# EAGLE schematic MARI_SCH (EAGLE 9.7.0)
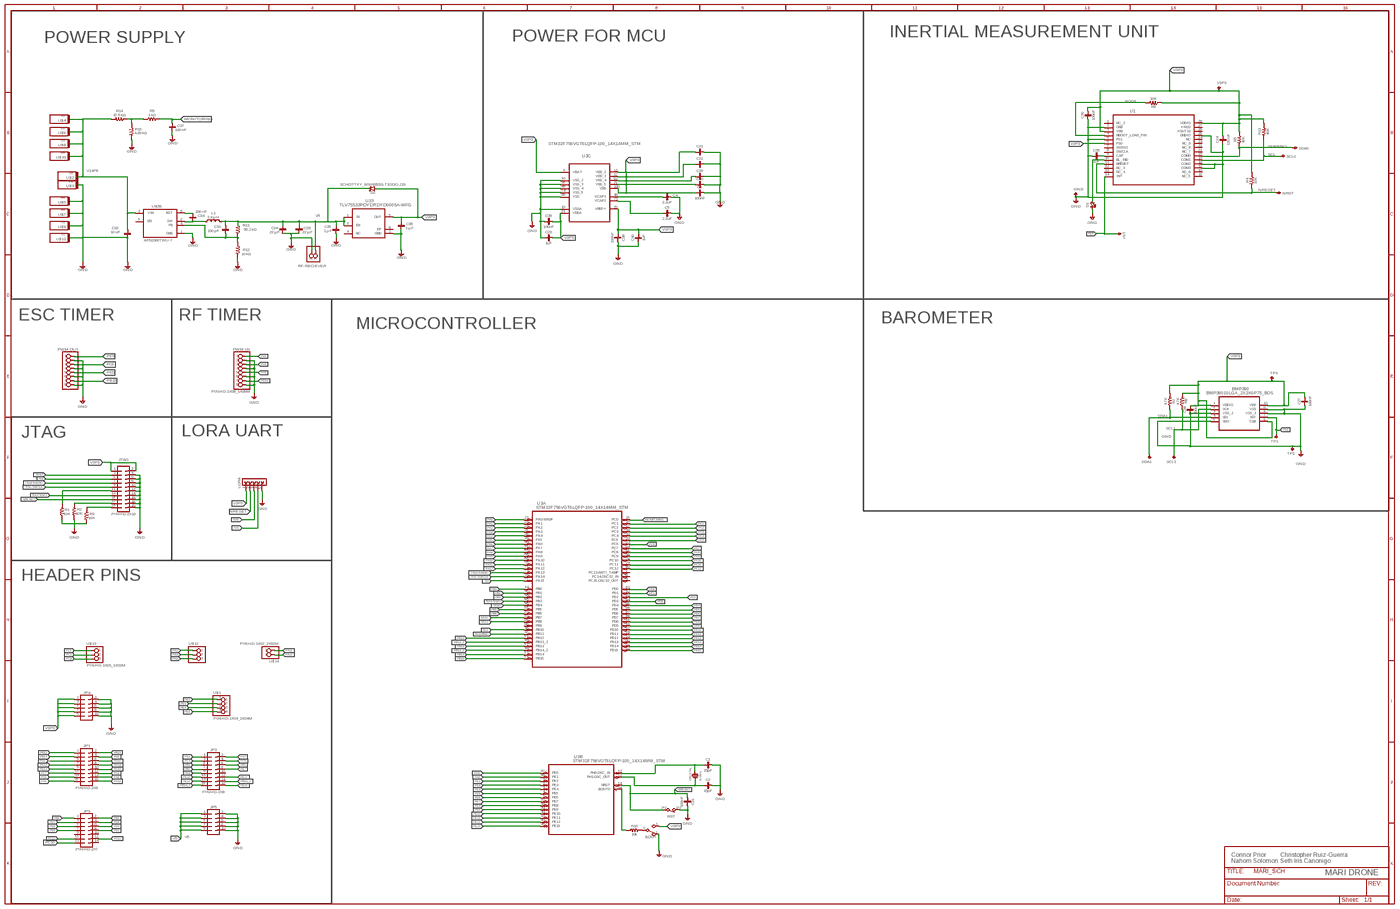
[diagram p0: schematic, sheet 1, overview]
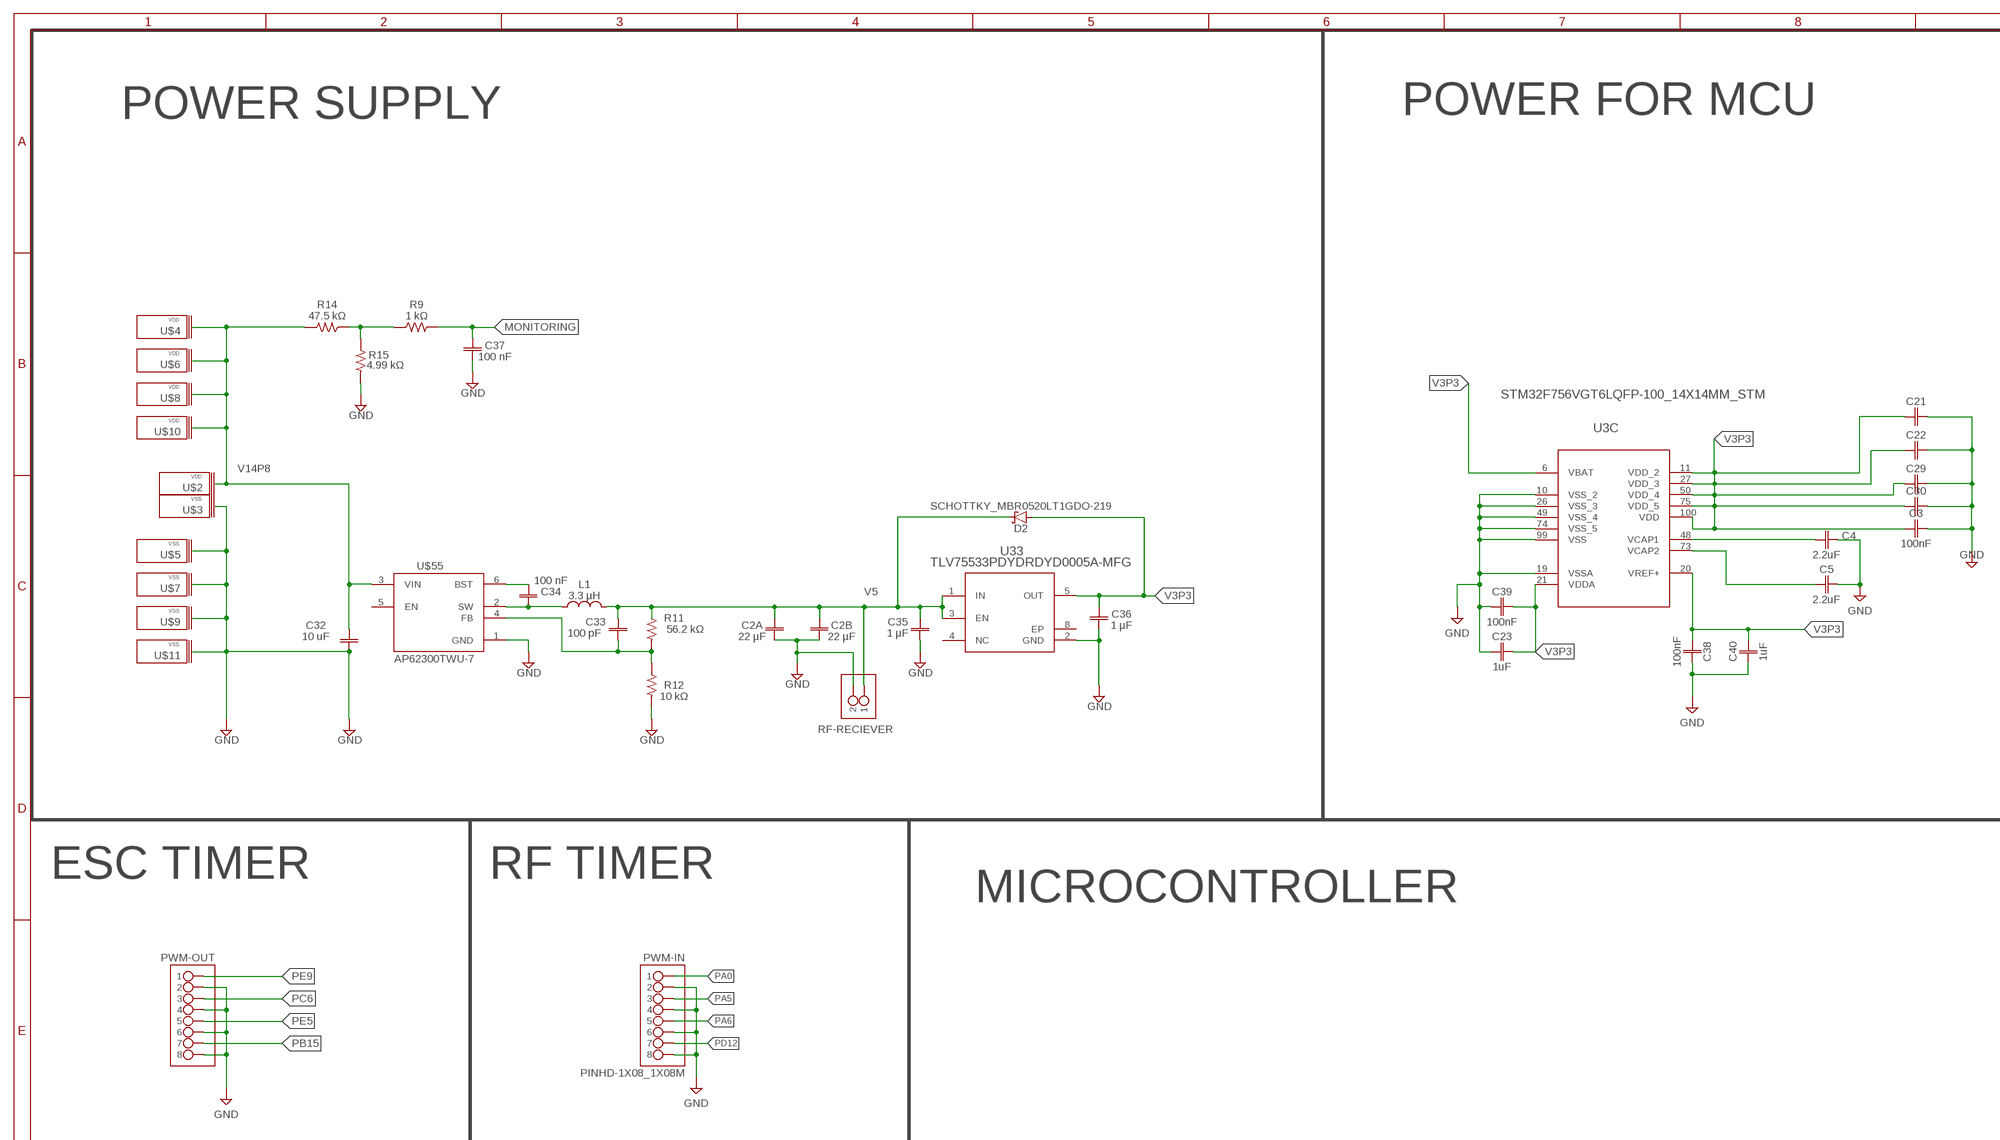
[diagram p1: schematic, sheet 1, part 1 of 4]
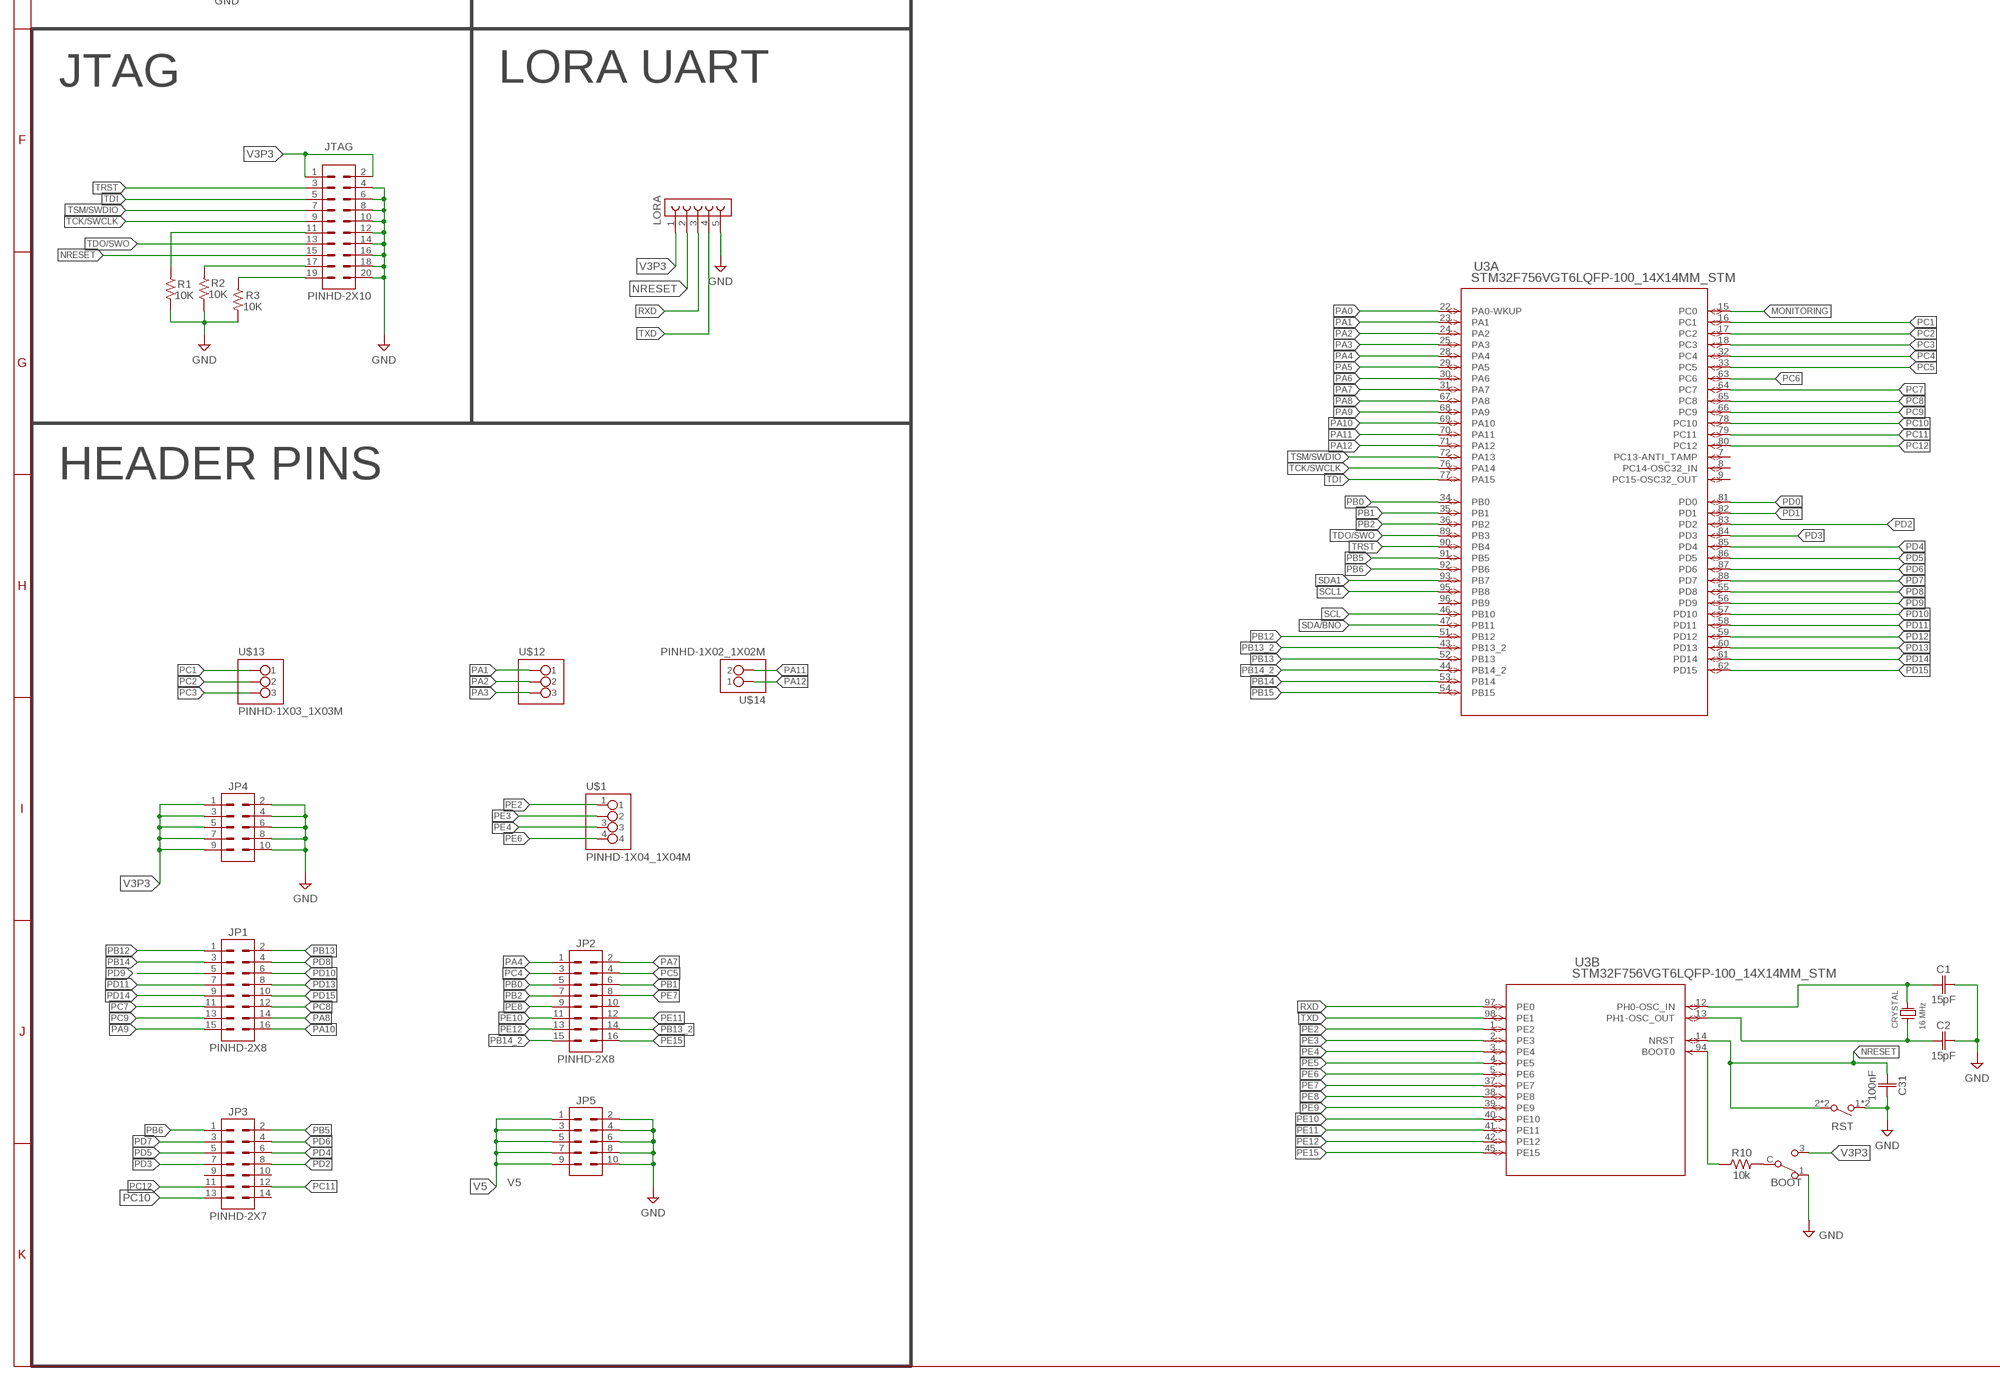
[diagram p2: schematic, sheet 1, part 2 of 4]
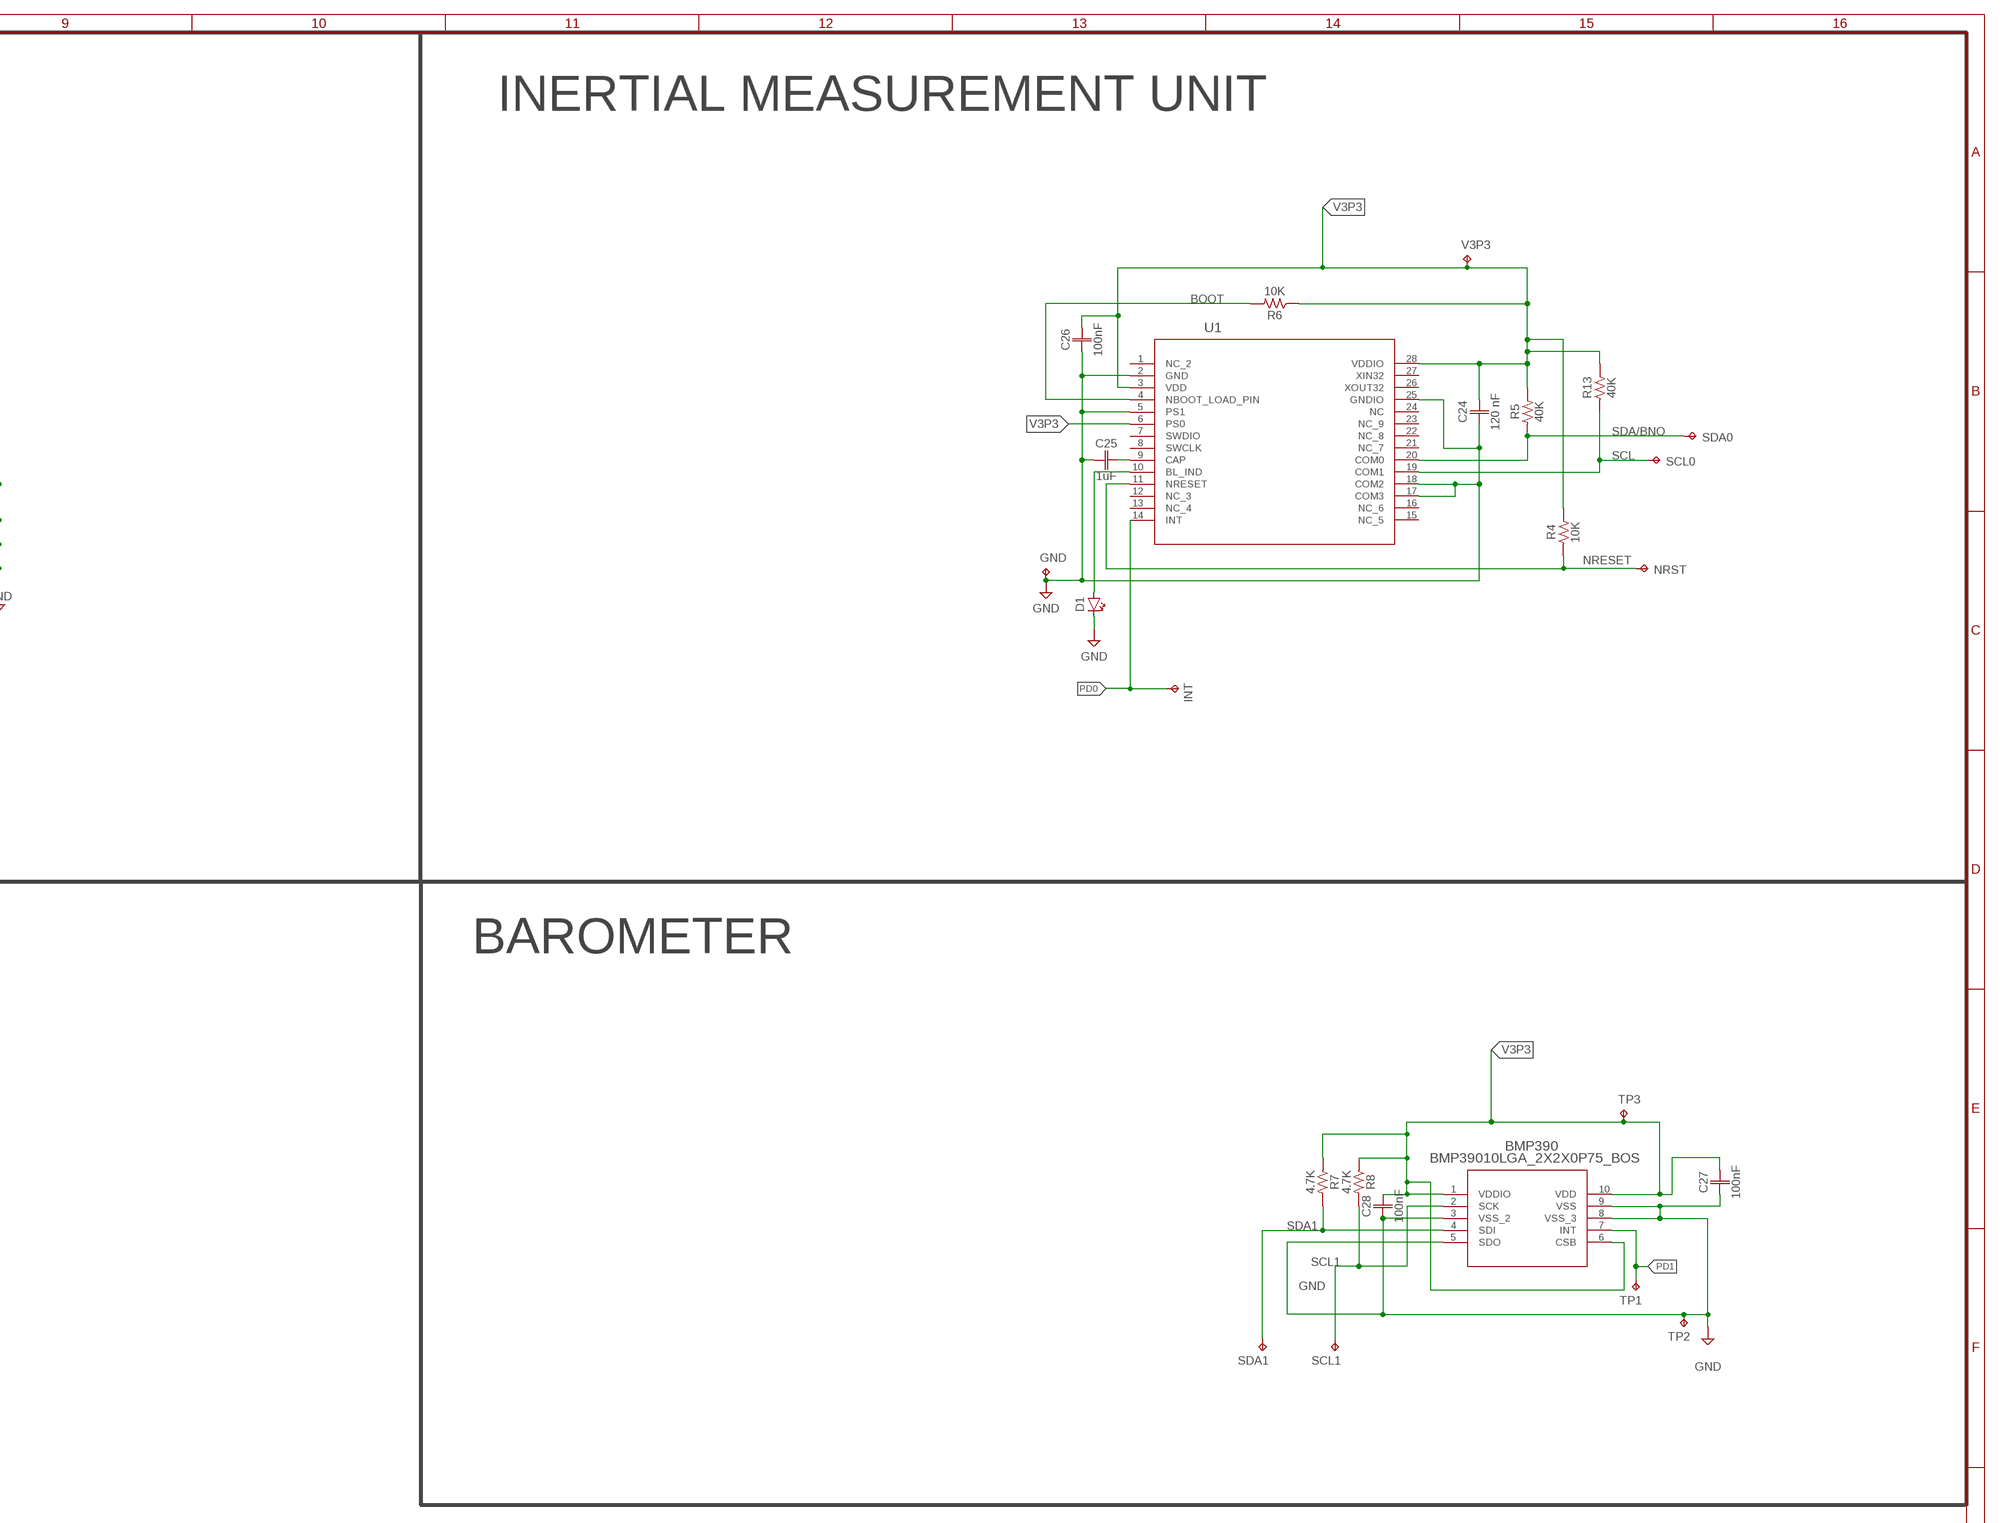
[diagram p3: schematic, sheet 1, part 3 of 4]
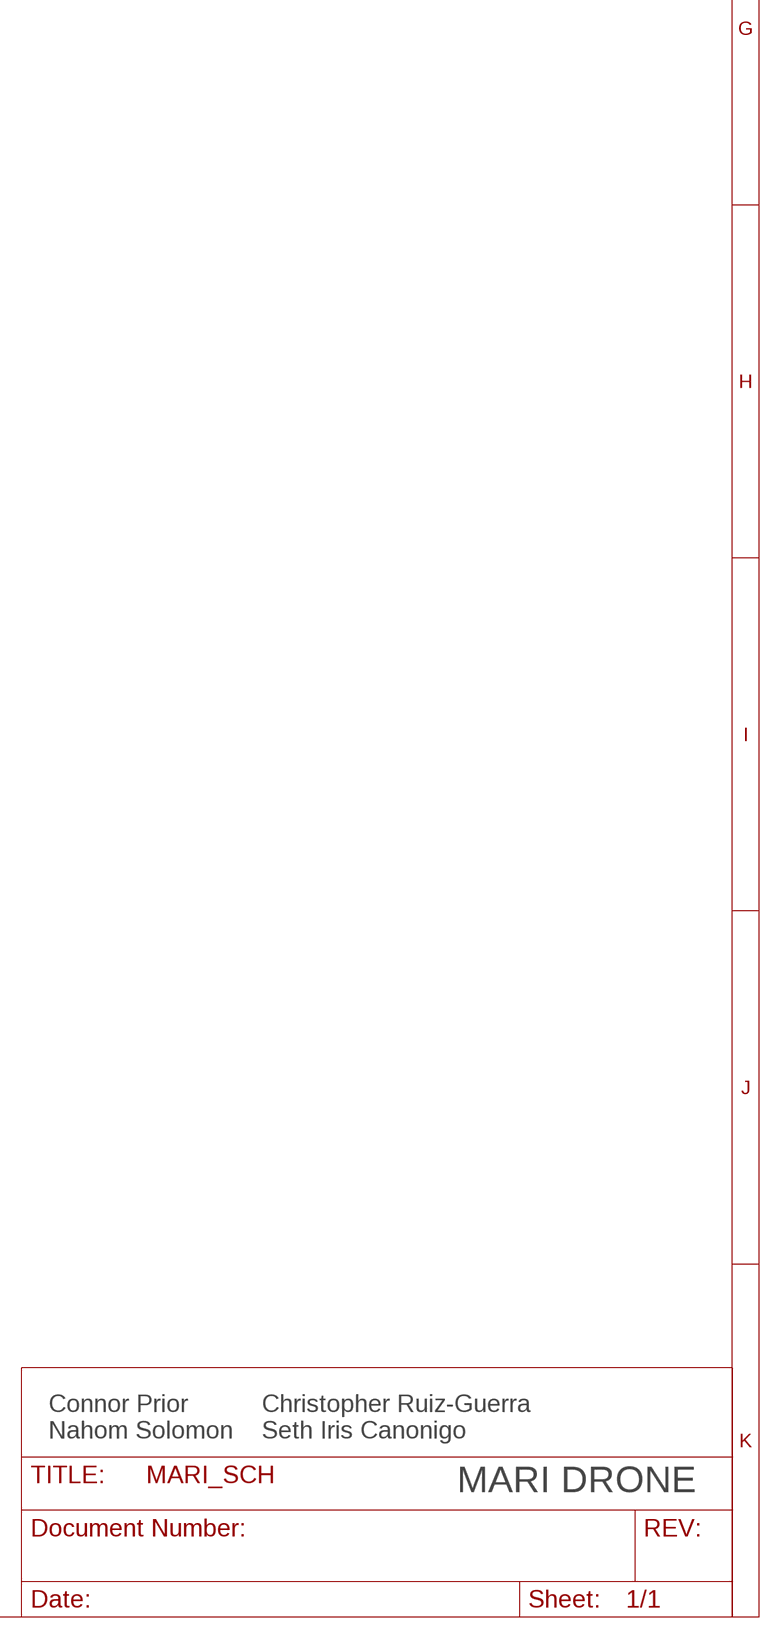
[diagram p4: schematic, sheet 1, part 4 of 4]

## Parts
BMP390  BMP39010LGA_2X2X0P75_BOS  [10LGA_2X2X0P75_BOS]
BOOT  SPDT_SWITCH_CL-SB-12B-01T  [CL-SB-12B-01T]
C1  15pF  C_CHIP-0402(1005-METRIC)  [CAPC1005X60]
C2  15pF  C_CHIP-0402(1005-METRIC)  [CAPC1005X60]
C2A  22 µF  C_CHIP-0402(1005-METRIC)  [CAPC1005X60]
C2B  22 µF  C_CHIP-0402(1005-METRIC)  [CAPC1005X60]
C3  100nF  C_CHIP-0402(1005-METRIC)  [CAPC1005X60]
C4  2.2uF  C_CHIP-0402(1005-METRIC)  [CAPC1005X60]
C5  2.2uF  C_CHIP-0402(1005-METRIC)  [CAPC1005X60]
C21  100nF  C_CHIP-0402(1005-METRIC)  [CAPC1005X60]
C22  100nF  C_CHIP-0402(1005-METRIC)  [CAPC1005X60]
C23  1uF  C_CHIP-0402(1005-METRIC)  [CAPC1005X60]
C24  120 nF  C_CHIP-0402(1005-METRIC)  [CAPC1005X60]
C25  1uF  C_CHIP-0402(1005-METRIC)  [CAPC1005X60]
C26  100nF  C_CHIP-0402(1005-METRIC)  [CAPC1005X60]
C27  100nF  C_CHIP-0402(1005-METRIC)  [CAPC1005X60]
C28  100nF  C_CHIP-0402(1005-METRIC)  [CAPC1005X60]
C29  100nF  C_CHIP-0402(1005-METRIC)  [CAPC1005X60]
C30  100nF  C_CHIP-0402(1005-METRIC)  [CAPC1005X60]
C31  100nF  C_CHIP-0402(1005-METRIC)  [CAPC1005X60]
C32  10 uF  C_CHIP-0805(2012-METRIC)  [CAPC2012X110]
C33  100 pF  C_CHIP-0402(1005-METRIC)  [CAPC1005X60]
C34  100 nF  C_CHIP-0402(1005-METRIC)  [CAPC1005X60]
C35  1 µF  C_CHIP-0402(1005-METRIC)  [CAPC1005X60]
C36  1 µF  C_CHIP-0402(1005-METRIC)  [CAPC1005X60]
C37  100 nF  C_CHIP-0402(1005-METRIC)  [CAPC1005X60]
C38  100nF  C_CHIP-0402(1005-METRIC)  [CAPC1005X60]
C39  100nF  C_CHIP-0402(1005-METRIC)  [CAPC1005X60]
C40  1uF  C_CHIP-0402(1005-METRIC)  [CAPC1005X60]
CRYSTAL  16 MHz  STDCRG1-16M  [STDCRG1-16M]
D1  CHIP-FLAT-R_0402  [LEDC1005X25N_FLAT-R]
D2  SCHOTTKY_MBR0520LT1GDO-219  [SODFL3718X115]
GND  TPB1,27  [B1,27]
INT  TPB1,27  [B1,27]
JP1  PINHD-2X8  [2X08]
JP2  PINHD-2X8  [2X08]
JP3  PINHD-2X7  [2X07]
JP4  PINHD-2X5  [2X05]
JP5  PINHD-2X5  [2X05]
JTAG  PINHD-2X10  [2X10]
L1  3.3 µH  L_CHIP-0603(1608-METRIC)  [INDC1608X95N]
LORA  FEMALE-HEADER-1X5  [1X05]
NRST  TPB1,27  [B1,27]
PWM-IN  PINHD-1X08_1X08M  [1X08]
PWM-OUT  PINHD-1X08_1X08M  [1X08]
R1  10K  R-US_CHIP-0402(1005-METRIC)  [RESC1005X40]
R2  10K  R-US_CHIP-0402(1005-METRIC)  [RESC1005X40]
R3  10K  R-US_CHIP-0402(1005-METRIC)  [RESC1005X40]
R4  10K  R-US_CHIP-0402(1005-METRIC)  [RESC1005X40]
R5  40K  R-US_CHIP-0402(1005-METRIC)  [RESC1005X40]
R6  10K  R-US_CHIP-0402(1005-METRIC)  [RESC1005X40]
R7  4.7K  R-US_CHIP-0402(1005-METRIC)  [RESC1005X40]
R8  4.7K  R-US_CHIP-0402(1005-METRIC)  [RESC1005X40]
R9  1 kΩ  R-US_CHIP-0402(1005-METRIC)  [RESC1005X40]
R10  10k  R-US_CHIP-0402(1005-METRIC)  [RESC1005X40]
R11  56.2 kΩ  R-US_CHIP-0402(1005-METRIC)  [RESC1005X40]
R12  10 kΩ  R-US_CHIP-0402(1005-METRIC)  [RESC1005X40]
R13  40K  R-US_CHIP-0402(1005-METRIC)  [RESC1005X40]
R14  47.5 kΩ  R-US_CHIP-0402(1005-METRIC)  [RESC1005X40]
R15  4.99 kΩ  R-US_CHIP-0402(1005-METRIC)  [RESC1005X40]
RF-RECIEVER  PINHD-1X02_1X02M  [1X02]
RST  SPST-NO_SWITCH_KMR2  [KMR2]
SCL0  TPB1,27  [B1,27]
SCL1  TPB1,27  [B1,27]
SDA0  TPB1,27  [B1,27]
SDA1  TPB1,27  [B1,27]
TP1  TPB1,27  [B1,27]
TP2  TPB1,27  [B1,27]
TP3  TPB1,27  [B1,27]
U1  BNO055QFN_BNO055_BOS  [QFN_BNO055_BOS]
U3  STM32F756VGT6LQFP-100_14X14MM_STM  [LQFP-100_14X14MM_STM]
U33  TLV75533PDYDRDYD0005A-MFG  [DYD0005A-MFG]
U$1  PINHD-1X04_1X04M  [1X04]
U$2  VDD  4MM_FEMALE_VDD  [4MM_PLUG]
U$3  VSS  4MM_FEMALE_VSS  [4MM_PLUG]
U$4  VDD  4MM_FEMALE_VDD  [4MM_PLUG]
U$5  VSS  4MM_FEMALE_VSS  [4MM_PLUG]
U$6  VDD  4MM_FEMALE_VDD  [4MM_PLUG]
U$7  VSS  4MM_FEMALE_VSS  [4MM_PLUG]
U$8  VDD  4MM_FEMALE_VDD  [4MM_PLUG]
U$9  VSS  4MM_FEMALE_VSS  [4MM_PLUG]
U$10  VDD  4MM_FEMALE_VDD  [4MM_PLUG]
U$11  VSS  4MM_FEMALE_VSS  [4MM_PLUG]
U$12  PINHD-1X03_1X03M  [1X03]
U$13  PINHD-1X03_1X03M  [1X03]
U$14  PINHD-1X02_1X02M  [1X02]
U$55  AP62300TWU-7  [SOT95P280X100-6N]
V3P3  TPB1,27  [B1,27]

## Nets
BL_IND: D1.A U1.10(BL_IND)
BOOT: R6.2 U1.4(NBOOT_LOAD_PIN)
GND: BMP390.3(VSS_2) BMP390.5(SDO) BMP390.8(VSS_3) BMP390.9(VSS) BOOT.1(NC) C1.2 C2.2 C2A.2 C2B.2 C3.2 C4.2 C5.2 C21.2 C22.2 C23.1 C24.1 C25.1 C26.1 C27.1 C28.1 C29.2 C30.2 C31.2 C32.1 C35.1 C36.1 C37.2 C38.2 C39.1 C40.1 D1.C GND.TP JP4.2 JP4.4 JP4.6 JP4.8 JP4.10 JP5.2 JP5.4 JP5.6 JP5.8 JP5.10 JTAG.4 JTAG.6 JTAG.8 JTAG.10 JTAG.12 JTAG.14 JTAG.16 JTAG.18 JTAG.20 LORA.5 PWM-IN.2 PWM-IN.4 PWM-IN.6 PWM-IN.8 PWM-OUT.2 PWM-OUT.4 PWM-OUT.6 PWM-OUT.8 R1.2 R2.2 R3.2 R12.1 R15.1 RF-RECIEVER.2 RST.1 RST.4 TP2.TP U1.2(GND) U1.5(PS1) U1.17(COM3) U1.18(COM2) U1.25(GNDIO) U3.10(C:VSS_2) U3.19(C:VSSA) U3.26(C:VSS_3) U3.49(C:VSS_4) U3.74(C:VSS_5) U3.99(C:VSS) U33.2(GND) U$3.P$1 U$5.P$1 U$7.P$1 U$9.P$1 U$11.P$1 U$55.1(GND)
MONITORING: C37.1 R9.2 U3.15(A:PC0)
N$9: C33.1 R11.1 R12.2 U$55.4(FB)
N$15: C25.2 U1.9(CAP)
N$17: JTAG.11 R1.1
N$18: C1.1 CRYSTAL.P$3 U3.12(B:PH0-OSC_IN)
N$19: JTAG.17 R2.1
N$20: JTAG.19 R3.1
N$21: C2.1 CRYSTAL.P$1 U3.13(B:PH1-OSC_OUT)
N$23: C4.1 U3.48(C:VCAP1)
N$24: C5.1 U3.73(C:VCAP2)
N$25: R10.1 U3.94(B:BOOT0)
N$26: BOOT.C(COM) R10.2
N$31: R9.1 R14.1 R15.2
NRESET: C31.1 JTAG.15 LORA.2 NRST.TP R4.1 RST.2 RST.3 U1.11(NRESET) U3.14(B:NRST)
PA0: PWM-IN.1 U3.22(A:PA0-WKUP)
PA1: U3.23(A:PA1) U$12.1
PA2: U3.24(A:PA2) U$12.2
PA3: U3.25(A:PA3) U$12.3
PA4: JP2.1 U3.28(A:PA4)
PA5: PWM-IN.3 U3.29(A:PA5)
PA6: PWM-IN.5 U3.30(A:PA6)
PA7: JP2.2 U3.31(A:PA7)
PA8: JP1.14 U3.67(A:PA8)
PA9: JP1.15 U3.68(A:PA9)
PA10: JP1.16 U3.69(A:PA10)
PA11: U3.70(A:PA11) U$14.2
PA12: U3.71(A:PA12) U$14.1
PB0: JP2.5 U3.34(A:PB0)
PB1: JP2.6 U3.35(A:PB1)
PB2: JP2.7 U3.36(A:PB2)
PB5: JP3.2 U3.91(A:PB5)
PB6: JP3.1 U3.92(A:PB6)
PB12: JP1.1 U3.51(A:PB12)
PB13: JP1.2 U3.52(A:PB13)
PB13_2: JP2.14 U3.43(A:PB13_2)
PB14: JP1.3 U3.53(A:PB14)
PB14_2: JP2.15 U3.44(A:PB14_2)
PB15: PWM-OUT.7 U3.54(A:PB15)
PC1: U3.16(A:PC1) U$13.1
PC2: U3.17(A:PC2) U$13.2
PC3: U3.18(A:PC3) U$13.3
PC4: JP2.3 U3.32(A:PC4)
PC5: JP2.4 U3.33(A:PC5)
PC6: PWM-OUT.3 U3.63(A:PC6)
PC7: JP1.11 U3.64(A:PC7)
PC8: JP1.12 U3.65(A:PC8)
PC9: JP1.13 U3.66(A:PC9)
PC10: JP3.13 U3.78(A:PC10)
PC11: JP3.12 U3.79(A:PC11)
PC12: JP3.11 U3.80(A:PC12)
PD0: INT.TP U1.14(INT) U3.81(A:PD0)
PD1: BMP390.7(INT) TP1.TP U3.82(A:PD1)
PD2: JP3.8 U3.83(A:PD2)
PD3: JP3.7 U3.84(A:PD3)
PD4: JP3.6 U3.85(A:PD4)
PD5: JP3.5 U3.86(A:PD5)
PD6: JP3.4 U3.87(A:PD6)
PD7: JP3.3 U3.88(A:PD7)
PD8: JP1.4 U3.55(A:PD8)
PD9: JP1.5 U3.56(A:PD9)
PD10: JP1.6 U3.57(A:PD10)
PD11: JP1.7 U3.58(A:PD11)
PD12: PWM-IN.7 U3.59(A:PD12)
PD13: JP1.8 U3.60(A:PD13)
PD14: JP1.9 U3.61(A:PD14)
PD15: JP1.10 U3.62(A:PD15)
PE2: U3.1(B:PE2) U$1.1
PE3: U3.2(B:PE3) U$1.2
PE4: U3.3(B:PE4) U$1.3
PE5: PWM-OUT.5 U3.4(B:PE5)
PE6: U3.5(B:PE6) U$1.4
PE7: JP2.8 U3.37(B:PE7)
PE8: JP2.9 U3.38(B:PE8)
PE9: PWM-OUT.1 U3.39(B:PE9)
PE10: JP2.11 U3.40(B:PE10)
PE11: JP2.12 U3.41(B:PE11)
PE12: JP2.13 U3.42(B:PE12)
PE15: JP2.16 U3.45(B:PE15)
RXD: LORA.3 U3.97(B:PE0)
SCL: R13.1 SCL0.TP U1.19(COM1) U3.46(A:PB10)
SCL1: BMP390.2(SCK) R8.2 SCL1.TP U3.95(A:PB8)
SDA1: BMP390.4(SDI) R7.2 SDA1.TP U3.93(A:PB7)
SDA/BNO: R5.1 SDA0.TP U1.20(COM0) U3.47(A:PB11)
SW: C34.1 L1.1 U$55.2(SW)
TCK/SWCLK: JTAG.9 U3.76(A:PA14)
TDI: JTAG.5 U3.77(A:PA15)
TDO/SWO: JTAG.13 U3.89(A:PB3)
TMP: C34.2 U$55.6(BST)
TRST: JTAG.3 U3.90(A:PB4)
TSM/SWDIO: JTAG.7 U3.72(A:PA13)
TXD: LORA.4 U3.98(B:PE1)
V3P3: BMP390.1(VDDIO) BMP390.6(CSB) BMP390.10(VDD) BOOT.3(NO) C3.1 C21.1 C22.1 C23.2 C24.2 C26.2 C27.2 C28.2 C29.1 C30.1 C36.2 C38.1 C39.2 C40.2 D2.2(A) JP4.1 JP4.3 JP4.5 JP4.7 JP4.9 JTAG.1 JTAG.2 LORA.1 R4.2 R5.2 R6.1 R7.1 R8.1 R13.2 TP3.TP U1.3(VDD) U1.6(PS0) U1.28(VDDIO) U3.6(C:VBAT) U3.11(C:VDD_2) U3.20(C:VREF+) U3.21(C:VDDA) U3.27(C:VDD_3) U3.50(C:VDD_4) U3.75(C:VDD_5) U3.100(C:VDD) U33.5(OUT) V3P3.TP
V5: C2A.1 C2B.1 C33.2 C35.2 D2.1(C) JP5.1 JP5.3 JP5.5 JP5.7 JP5.9 L1.2 R11.2 RF-RECIEVER.1 U33.1(IN) U33.3(EN)
V14P8: C32.2 R14.2 U$2.P$1 U$4.P$1 U$6.P$1 U$8.P$1 U$10.P$1 U$55.3(VIN)
Unconnected: JP2.10 JP3.9 JP3.10 JP3.14 U1.1(NC_2) U1.7(SWDIO) U1.8(SWCLK) U1.12(NC_3) U1.13(NC_4) U1.15(NC_5) U1.16(NC_6) U1.21(NC_7) U1.22(NC_8) U1.23(NC_9) U1.24(NC) U1.26(XOUT32) U1.27(XIN32) U3.7(A:PC13-ANTI_TAMP) U3.8(A:PC14-OSC32_IN) U3.9(A:PC15-OSC32_OUT) U3.96(A:PB9) U33.4(NC) U33.8(EP) U$55.5(EN)

## Notes on the sheet
- POWER FOR MCU | INERTIAL MEASUREMENT UNIT
- POWER SUPPLY
- ESC TIMER | RF TIMER | BAROMETER
- MICROCONTROLLER
- JTAG | LORA UART
- HEADER PINS
- Connor Prior
  Nahom Solomon
- Christopher Ruiz-Guerra
  Seth Iris Canonigo
- MARI DRONE

## Library data of the parts
BMP390 = BMP390:BMP390; COPYRIGHT: Copyright (C) 2025 Ultra Librarian. All rights reserved.; MANUFACTURER_NAME: Bosch Sensortec; MANUFACTURER_PART_NUMBER: BMP390
BOOT = Switch:SPDT_SWITCH: SPDT Switches; CATEGORY: Switches; DATASHEET: https://www.nidec-components.com/e/catalog/switch/cl-sb.pdf; DESCRIPTION: Slide Switch SPDT Surface Mount; MANUFACTURER: Nidec Components Corporation; MPN: CL-SB-12B-01T; OPERATING_TEMPERATURE: -40°C ~ 85°C; PACKAGE_SIZE: NA; PACKAGE_TYPE: Surface Mount; PART_STATUS: Active; ROHS: Compliant; SERIES: CL-SB; SUBCATEGORY: Slide Switches; TYPE: SPDT
C1 C2 C2A C2B C3-C5 C21-C31 C33-C40 = Capacitor:C: Capacitor - Generic; CATEGORY: Capacitor; PACKAGE_SIZE: 0402; PACKAGE_TYPE: Surface Mount; SUBCATEGORY: Ceramic Capacitors; TYPE: MLCC
C32 = Capacitor:C: Capacitor - Generic; CATEGORY: Capacitor; PACKAGE_SIZE: 0805; PACKAGE_TYPE: Surface Mount; SUBCATEGORY: Ceramic Capacitors; TYPE: MLCC
CRYSTAL = STDCRG1-16M:STDCRG1-16M
D1 = LED:CHIP-FLAT-R: Red LED - Generic; CATEGORY: LED; COLOR: Red; DESCRIPTION: Red LED Indication 0402 (1005 Metric); PACKAGE_SIZE: 0402; PACKAGE_TYPE: Surface Mount; SUBCATEGORY: Chip LED; TYPE: Square with Flat Top
D2 = Diode:SCHOTTKY_: Schottky Diode - Popular Parts; CATEGORY: Diode; DATASHEET: https://www.onsemi.com/download/data-sheet/pdf/mbr0520lt1-d.pdf; DESCRIPTION: Diode 20 V 500mA Surface Mount SOD-123; FORWARD_CURRENT: 500mA; FORWARD_VOLTAGE: 385mV; MANUFACTURER: onsemi; MPN: MBR0520LT1G; OPERATING_TEMPERATURE: -65°C ~ 125°C; PACKAGE_SIZE: SOD-123; PACKAGE_TYPE: Surface Mount; PART_STATUS: Active; REVERSE_VOLTAGE: 20V; ROHS: Compliant; SERIES: MBR0520; SUBCATEGORY: Schottky Diodes; TYPE: Schottky Power Rectifier; ZENER_VOLTAGE: NA
GND INT NRST SCL0 SCL1 SDA0 SDA1 TP1-TP3 V3P3 = testpad:TP: Test pad
JP1 JP2 = Connector:PINHD-2X8: Pin Header; CATEGORY: Connectors; DESCRIPTION: Header-Straight-2x8 Position; PACKAGE_TYPE: Through Hole; PITCH: 0.100" (2.54mm); SUBCATEGORY: Headers; TYPE: Male Pins
JP3 = Connector:PINHD-2X7: Pin Header; CATEGORY: Connectors; DESCRIPTION: Header-Straight-2x7 Position; PACKAGE_TYPE: Through Hole; PITCH: 0.100" (2.54mm); SUBCATEGORY: Headers; TYPE: Male Pins
JP4 JP5 = Connector:PINHD-2X5: Pin Header; CATEGORY: Connectors; DESCRIPTION: Header-Straight-2x5 Position; PACKAGE_TYPE: Through Hole; PITCH: 0.100" (2.54mm); SUBCATEGORY: Headers; TYPE: Male Pins
JTAG = Connector:PINHD-2X10: Pin Header; CATEGORY: Connectors; DESCRIPTION: Header-Straight-2x10 Position; PACKAGE_TYPE: Through Hole; PITCH: 0.100" (2.54mm); SUBCATEGORY: Headers; TYPE: Male Pins
L1 = Inductor:L: Inductor Fixed - Generic; CATEGORY: Inductors; DESCRIPTION: Chip 1.60 X 0.80 X 0.95 mm body 0603(1608-METRIC); PACKAGE_SIZE: 0603; PACKAGE_TYPE: Surface Mount
LORA = Connector:FEMALE-HEADER-1X5: Connector Header; CATEGORY: Connectors; DESCRIPTION: Female Header-Straight-5 Position; PACKAGE_SIZE: NA; PACKAGE_TYPE: Through Hole; PITCH: 0.100" (2.54mm); SUBCATEGORY: Headers-Female Pins
PWM-IN PWM-OUT = Tinkercad:PINHD-1X08
R1-R15 = Resistor:R-US: Resistor Fixed - ANSI; CATEGORY: Resistors; DESCRIPTION: Chip Resistor 1.05 X 0.54 X 0.40 mm body 0402(1005-METRIC) Package; PACKAGE_SIZE: 0402; PACKAGE_TYPE: Surface Mount
RF-RECIEVER U$14 = Tinkercad:PINHD-1X02
RST = Switch:SPST-NO_SWITCH: SPST Switches with NO Configuration; CATEGORY: Switches; DATASHEET: https://www.ckswitches.com/media/1479/kmr2.pdf; DESCRIPTION: Tactile Switch SPST-NO Top Actuated Surface Mount; MANUFACTURER: C&K; MPN: KMR211G LFS; OPERATING_TEMPERATURE: -40°C ~ 85°C; PACKAGE_SIZE: NA; PACKAGE_TYPE: Surface Mount; PART_STATUS: Active; ROHS: Compliant; SERIES: KMR2; SUBCATEGORY: Tactile Switches; TYPE: SPST-NO
U1 = BNO055:BNO055; COPYRIGHT: Copyright (C) 2025 Ultra Librarian. All rights reserved.; MANUFACTURER_NAME: Bosch Sensortec; MANUFACTURER_PART_NUMBER: BNO055
U3 = STM32F756VGT6:STM32F756VGT6; COPYRIGHT: Copyright (C) 2025 Ultra Librarian. All rights reserved.; DATASHEET: https://www.st.com/resource/en/datasheet/stm32f756bg.pdf; DESCRIPTION: High-performance and DSP with FPU, Arm Cortex-M7 MCU with 1 Mbyte of Flash memory, 216 MHz CPU, Art Accelerator, L1 cache, HW crypto, SDRAM, TFT; MANUFACTURER_NAME: STMicroelectronics; MANUFACTURER_PART_NUMBER: STM32F756VGT6
U33 = TLV75533PDYDR:TLV75533PDYDR; COPYRIGHT: Copyright (C) 2025 Ultra Librarian. All rights reserved.; DATASHEET: https://www.ti.com/lit/gpn/tlv755p; DESCRIPTION: 500mA high-PSRR low-I<sub>Q</sub> low-dropout voltage regulator with enable 5-SOT-23 -40 to 125; MANUFACTURER_NAME: Texas Instruments; MANUFACTURER_PART_NUMBER: TLV75533PDYDR; REFDES: RefDes; TYPE: TYPE
U$1 = Tinkercad:PINHD-1X04
U$2 U$4 U$6 U$8 U$10 = 4mm Banana Plug female:4MM_FEMALE_VDD: Gold-Plated 4mm 4.0mm Female Banana Plug Bullet Connector Adapter connected to VDD
U$3 U$5 U$7 U$9 U$11 = 4mm Banana Plug female:4MM_FEMALE_VSS: Gold-Plated 4mm 4.0mm Female Banana Plug Bullet Connector Adapter connected to VDD
U$12 U$13 = Tinkercad:PINHD-1X03
U$55 = Buck - AP62300TWU-7:AP62300TWU-7; MANUFACTURER: Diodes Inc.; MAXIMUM_PACKAGE_HEIGHT: 1.0mm; PARTREV: Rev. 3 - 2; SNAPEDA_PN: AP62300TWU-7; STANDARD: IPC 7351B